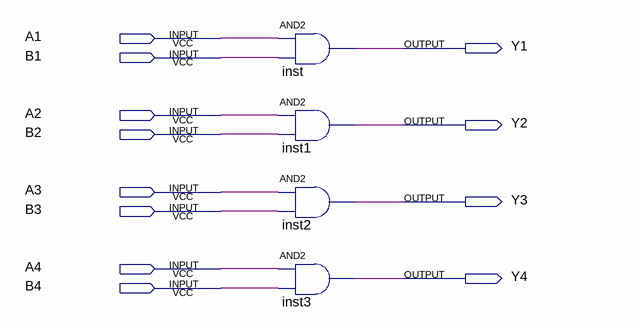
[diagram p0: schematic sheet]
// Quartus schematic SN74HC08.bdf as structural Verilog: 4 symbols, 12 pins
module SN74HC08 (
  input  A1,
  input  B1,
  input  A2,
  input  B2,
  input  A3,
  input  B3,
  input  A4,
  input  B4,
  output Y1,
  output Y2,
  output Y3,
  output Y4
);

  and inst (Y1, A1, B1);
  and inst1 (Y2, A2, B2);
  and inst2 (Y3, A3, B3);
  and inst3 (Y4, A4, B4);
endmodule
